# EasyEDA Pro project 20241014.epro

# Schematic EDA_LQ——13P——u
Board Name: EDA_LQ——13P——u; Create Date: 2024-10-10; Page Name: 13P1_SCH; Project Name: 20241010; Schematic Name: EDA_LQ——13P——u; Update Date: 2024-10-14; Add into BOM: yes; Company: Your Company; Convert to PCB: yes; Date: 2022-03-16; Draw By: tirion; REV: 1.0; Sheet: 1/1
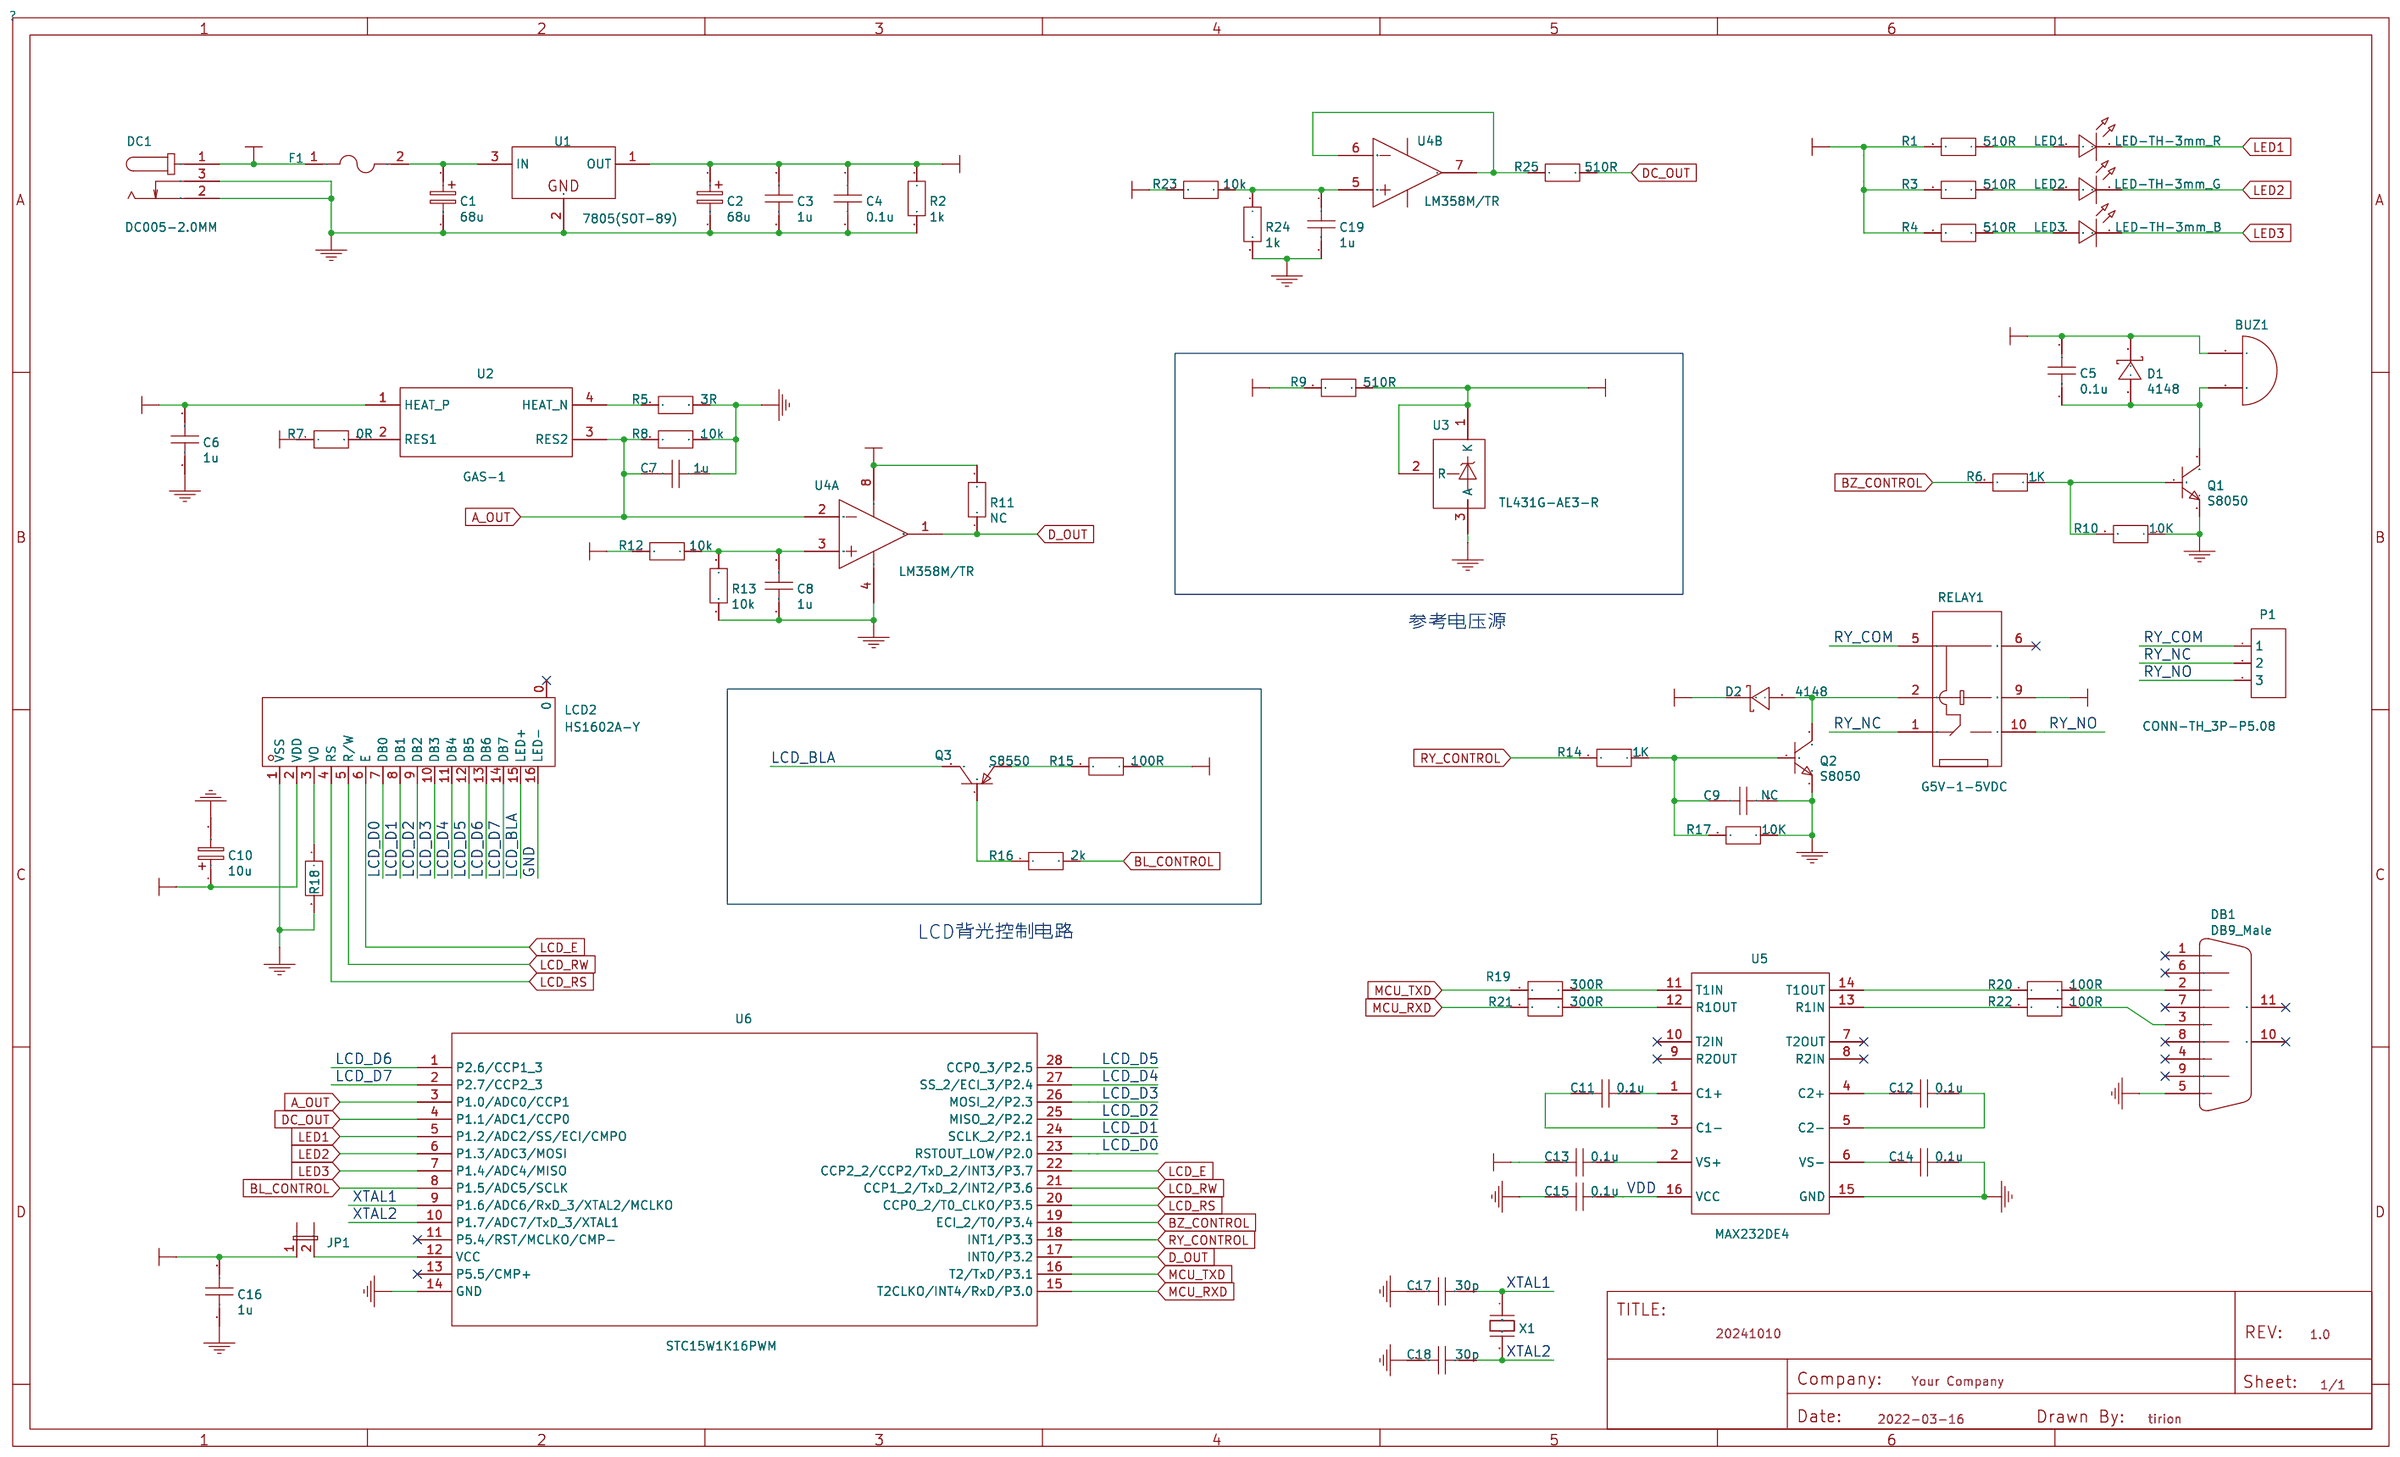
[diagram p0: schematic sheet]

## Parts
BUZ1  BUZ1  [BUZZ]
C1  68u  [CAP-D6.3×H5.5]
C2  68u  [CAP-D6.3×H5.5]
C3  1u  [C0805]
C4  0.1u  [C0805]
C5  0.1u  [C0805]
C6  1u  [C0805]
C7  1u  [C0805]
C8  1u  [C0805]
C9  NC  [C0805]
C10  10u  [CAP-D5.0×H5.5]
C11  0.1u  [C0805]
C12  0.1u  [C0805]
C13  0.1u  [C0805]
C14  0.1u  [C0805]
C15  0.1u  [C0805]
C16  1u  [C0805]
C17  30p  [C0805]
C18  30p  [C0805]
C19  1u  [C0805]
D1  4148  [SMA_L4.4-W2.8-LS5.4-RD]
D2  4148  [SMA_L4.4-W2.8-LS5.4-RD]
DB1  DB9_Male  [DSUB-TH_DMR-9P]
DC1  DC005-2.0MM  [DC-IN-TH_DC005]
F1  FUSE_F1812_FUSE  [F1812]
JP1  JUMPER2  [JUMPER2]
LCD2  HS1602A-Y  [LCD1602]
LED1  LED-TH-3mm_R  [LED-TH_BD3.0_RED]
LED2  LED-TH-3mm_G  [LED-TH_BD3.0_GREEN]
LED3  LED-TH-3mm_B  [LED-TH_BD3.0_BLUE]
P1  CONN-TH_3P-P5.08  [CONN-TH_3P-P5.08]
Q1  S8050  [SOT-23-3_L2.9-W1.3-P1.90-LS2.4-BR]
Q2  S8050  [SOT-23-3_L2.9-W1.3-P1.90-LS2.4-BR]
Q3  S8550  [SOT-23-3_L2.9-W1.3-P1.90-LS2.4-BR]
R1  510R  [R0805]
R2  1k  [R0805]
R3  510R  [R0805]
R4  510R  [R0805]
R5  3R  [R0805]
R6  1K  [R0805]
R7  0R  [R0805]
R8  10k  [R0805]
R9  510R  [R0805]
R10  10K  [R0805]
R11  NC  [R0805]
R12  10k  [R0805]
R13  10k  [R0805]
R14  1K  [R0805]
R15  100R  [R0805]
R16  2k  [R0805]
R17  10K  [R0805]
R18  10k  [R0805]
R19  300R  [R0805]
R20  100R  [R0805]
R21  300R  [R0805]
R22  100R  [R0805]
R23  10k  [R0805]
R24  1k  [R0805]
R25  510R  [R0805]
RELAY1  G5V-1-5VDC  [RELAY-TH_G5V-1]
U1  7805(SOT-89)  [SOT-89-3_L4.5-W2.5-P1.50-LS4.2-BR]
U2  GAS-1  [GAS-1]
U3  TL431G-AE3-R  [SOT-23-3_L2.9-W1.3-P1.90-LS2.4-TR]
U4  LM358M/TR  [SOP-8_L4.9-W3.9-P1.27-LS6.0-BL]  (sections 1,2)
U5  MAX232DE4  [SOIC16N]
U6  STC15W1K16PWM  [SOP-28_L17.9-W7.5-P1.27-LS10.3-BL]
X1  12MHZ  [OSC-49U-1]

## Library data of the parts
BUZ1 = BUZ1
C1 C2 = 68u
C3 C6-C8 C16 C19 = 1u
C4 C5 C11-C15 = 0.1u
C9 R11 = NC
C10 = 10u
C17 C18 = 30p
D1 D2 = SS14: Supplier: LCSC; Manufacturer: MDD; Supplier Part: C2480; JLCPCB Part Class: Basic Part
DB1 = DB9_Male: Supplier Part: C185657; Supplier: LCSC; Manufacturer: Amphenol
DC1 = DC005-2.0MM: Supplier: LCSC; Manufacturer: SOFNG; Supplier Part: C111567
F1 = FUSE_F1812_FUSE: Supplier: LCSC; Supplier Part: C9900007509; JLCPCB Part Class: Extended Part
JP1 = JUMPER2
LCD2 = HS1602A-Y: 主控芯片:SPLC780;尺寸(inch):2;; LCSC Part Name: 2寸16x2字符型8位通讯单色LCD液晶显示模组黄绿屏; Supplier Part: C18198250; Manufacturer: HS(汉昇); JLCPCB Part Class: 扩展库; Datasheet: https://atta.szlcsc.com/upload/public/pdf/source/20230921/41ABF4C08C578F5401713169C9FD3309.pdf; Supplier: LCSC; Main Control Chip: SPLC780; Size: 2; Operating Temperature: -20℃~+70℃
LED1 = 204-10SDRD/S530-A3-L: Manufacturer: EVERLIGHT(台湾亿光); Supplier Part: C84774; Supplier: LCSC
LED2 = 204-10SYGD/S530-E3: Manufacturer: EVERLIGHT(台湾亿光); Supplier Part: C85161
LED3 = 204-10SUBC/S400-A4: Manufacturer: EVERLIGHT(台湾亿光); Supplier Part: C86881; Supplier: LCSC
P1 = CONN-TH_3P-P5.08: Supplier: LCSC
Q1 Q2 = S8050: Supplier: LCSC; Supplier Part: C916390; Manufacturer: JSMSEMI; JLCPCB Part Class: Extended Part
Q3 = S8550-H: Supplier: LCSC; Supplier Part: C699225; Manufacturer: Yangzhou Yangjie Elec Tech; JLCPCB Part Class: Extended Part
R1 R3 R4 R9 R25 = 510R
R2 R24 = 1k
R5 = 3R
R6 R14 = 1K
R7 = 0R
R8 R12 R13 R18 R23 = 10k
R10 R17 = 10K
R15 R20 R22 = 100R
R16 = 2k
R19 R21 = 300R
RELAY1 = G5V-1-5VDC: Supplier: LCSC; Manufacturer: OMRON; Supplier Part: C28695; JLCPCB Part Class: Extended Part
U1 = CJ78L05: Supplier: LCSC; Manufacturer: CJ; image: //image.lceda.cn/szlcsc/C2079.jpg; Supplier Part: C2079; Paste Type: expand
U2 = GAS-1
U3 = TL431G-AE3-R: Supplier: LCSC; Manufacturer: UTC; Supplier Part: C71130; JLCPCB Part Class: Extended Part
U4 = LM358M/TR: Supplier: LCSC; Supplier Part: C398078; Manufacturer: HGSEMI
U5 = MAX232DE4
U6 = STC15W1K16PWM: Supplier: LCSC; Manufacturer: STC; Supplier Part: C65670; JLCPCB Part Class: Extended Part
X1 = X49UD12MSD2SC: Supplier Part: undefined; Supplier: LCSC; Manufacturer: LCSC

## Nets
GND: C1.2 C2.2 C3.2 C4.2 C6.1 C7.1 C8.2 C9.2 C10.2 C14.2 C15.1 C16.1 C17.2 C18.2 C19.2 DB1.5 DC1.2 DC1.3 LCD2.1(VSS) LCD2.16(LED-) Q1.2(E) Q2.2(E) R2.2 R5.2 R8.2 R10.1 R13.2 R17.1 R18.2 R24.2 U1.2(GND) U3.3(A) U4.4(GND) U5.15(GND) U6.14(GND)
VDD: BUZ1.1(A) C2.1 C3.1 C4.1 C5.2 C6.2 C10.1 C13.1 C15.2 C16.2 D1.1(K) D2.1(K) JP1.1 LCD2.2(VDD) R1.2 R2.1 R3.2 R4.2 R9.2 R11.2 R15.2 RELAY1.9 U1.1(OUT) U2.1(HEAT_P) U4.8(VCC) U5.16(VCC)
A_OUT: C7.2 R8.1 U2.3(RES2) U4.2(1IN-) U6.3(P1.0/ADC0/CCP1)
BL_CONTROL: R16.2 U6.8(P1.5/ADC5/SCLK)
BZ_CONTROL: R6.2 U6.19(ECI_2/T0/P3.4)
D_OUT: R11.1 U4.1(1OUT) U6.17(INT0/P3.2)
DC_IN: DC1.1 F1.1 R23.2
DC_OUT: R25.1 U6.4(P1.1/ADC1/CCP0)
LCD_BLA: LCD2.15(LED+) Q3.3(C)
LCD_D0: LCD2.7(DB0) U6.23(RSTOUT_LOW/P2.0)
LCD_D1: LCD2.8(DB1) U6.24(SCLK_2/P2.1)
LCD_D2: LCD2.9(DB2) U6.25(MISO_2/P2.2)
LCD_D3: LCD2.10(DB3) U6.26(MOSI_2/P2.3)
LCD_D4: LCD2.11(DB4) U6.27(SS_2/ECI_3/P2.4)
LCD_D5: LCD2.12(DB5) U6.28(CCP0_3/P2.5)
LCD_D6: LCD2.13(DB6) U6.1(P2.6/CCP1_3)
LCD_D7: LCD2.14(DB7) U6.2(P2.7/CCP2_3)
LCD_E: LCD2.6(E) U6.22(CCP2_2/CCP2/TxD_2/INT3/P3.7)
LCD_RS: LCD2.4(RS) U6.20(CCP0_2/T0_CLKO/P3.5)
LCD_RW: LCD2.5(R/W) U6.21(CCP1_2/TxD_2/INT2/P3.6)
LED1: LED1.2 U6.5(P1.2/ADC2/SS/ECI/CMPO)
LED2: LED2.2 U6.6(P1.3/ADC3/MOSI)
LED3: LED3.2 U6.7(P1.4/ADC4/MISO)
MCU_RXD: R21.1 U6.15(T2CLKO/INT4/RxD/P3.0)
MCU_TXD: R19.1 U6.16(T2/TxD/P3.1)
RY_COM: P1.1 RELAY1.5
RY_CONTROL: R14.2 U6.18(INT1/P3.3)
RY_NC: P1.2 RELAY1.1
RY_NO: P1.3 RELAY1.10
VREF: R7.1 R9.1 R12.2 U3.1(K) U3.2(R)
XTAL1: C17.1 U6.9(P1.6/ADC6/RxD_3/XTAL2/MCLKO) X1.1(OSC1)
XTAL2: C18.1 U6.10(P1.7/ADC7/TxD_3/XTAL1) X1.2(OSC2)
$1N2: R5.1 U2.4(HEAT_N)
$1N9: C8.1 R12.1 R13.1 U4.3(1IN+)
$1N21: C11.2 U5.1(C1+)
$1N22: C11.1 U5.3(C1-)
$1N25: C13.2 U5.2(VS+)
$1N27: C12.1 U5.4(C2+)
$1N28: C12.2 U5.5(C2-)
$1N29: C14.1 U5.6(VS-)
$1N32: R19.2 U5.11(T1IN)
$1N34: R21.2 U5.12(R1OUT)
$1N35: R20.1 U5.14(T1OUT)
$1N36: DB1.2 R20.2
$1N37: R22.1 U5.13(R1IN)
$1N38: DB1.3 R22.2
$1N41: JP1.2 U6.12(VCC)
$1N43: D2.2(A) Q2.3(C) RELAY1.2
$1N44: C9.1 Q2.1(B) R14.1 R17.2
$1N59: Q1.1(B) R6.1 R10.2
$1N60: BUZ1.2(B) C5.1 D1.2(A) Q1.3(C)
$1N64: LCD2.3(VO) R18.1
$1N97: LED1.1 R1.1
$1N99: LED3.1 R4.1
$1N100: LED2.1 R3.1
$1N103: C1.1 F1.2 U1.3(IN)
$1N105: R25.2 U4.6(2IN-) U4.7(2OUT)
$1N107: C19.1 R23.1 R24.1 U4.5(2IN+)
$1N1047: R7.2 U2.2(RES1)
$1N2313: Q3.1(B) R16.1
$1N2322: Q3.2(E) R15.1

Not connected (* = marked no-connect by the designer): DB1 1* 4* 6* 7* 8* 9* 10(MH1)* 11(MH2)*; LCD2 0*; RELAY1 6*; U5 7(T2OUT)* 8(R2IN)* 9(R2OUT)* 10(T2IN)*; U6 11(P5.4/RST/MCLKO/CMP-)* 13(P5.5/CMP+)*

## Notes on the sheet
- 参考电压源
- LCD背光控制电路

# Board PCB
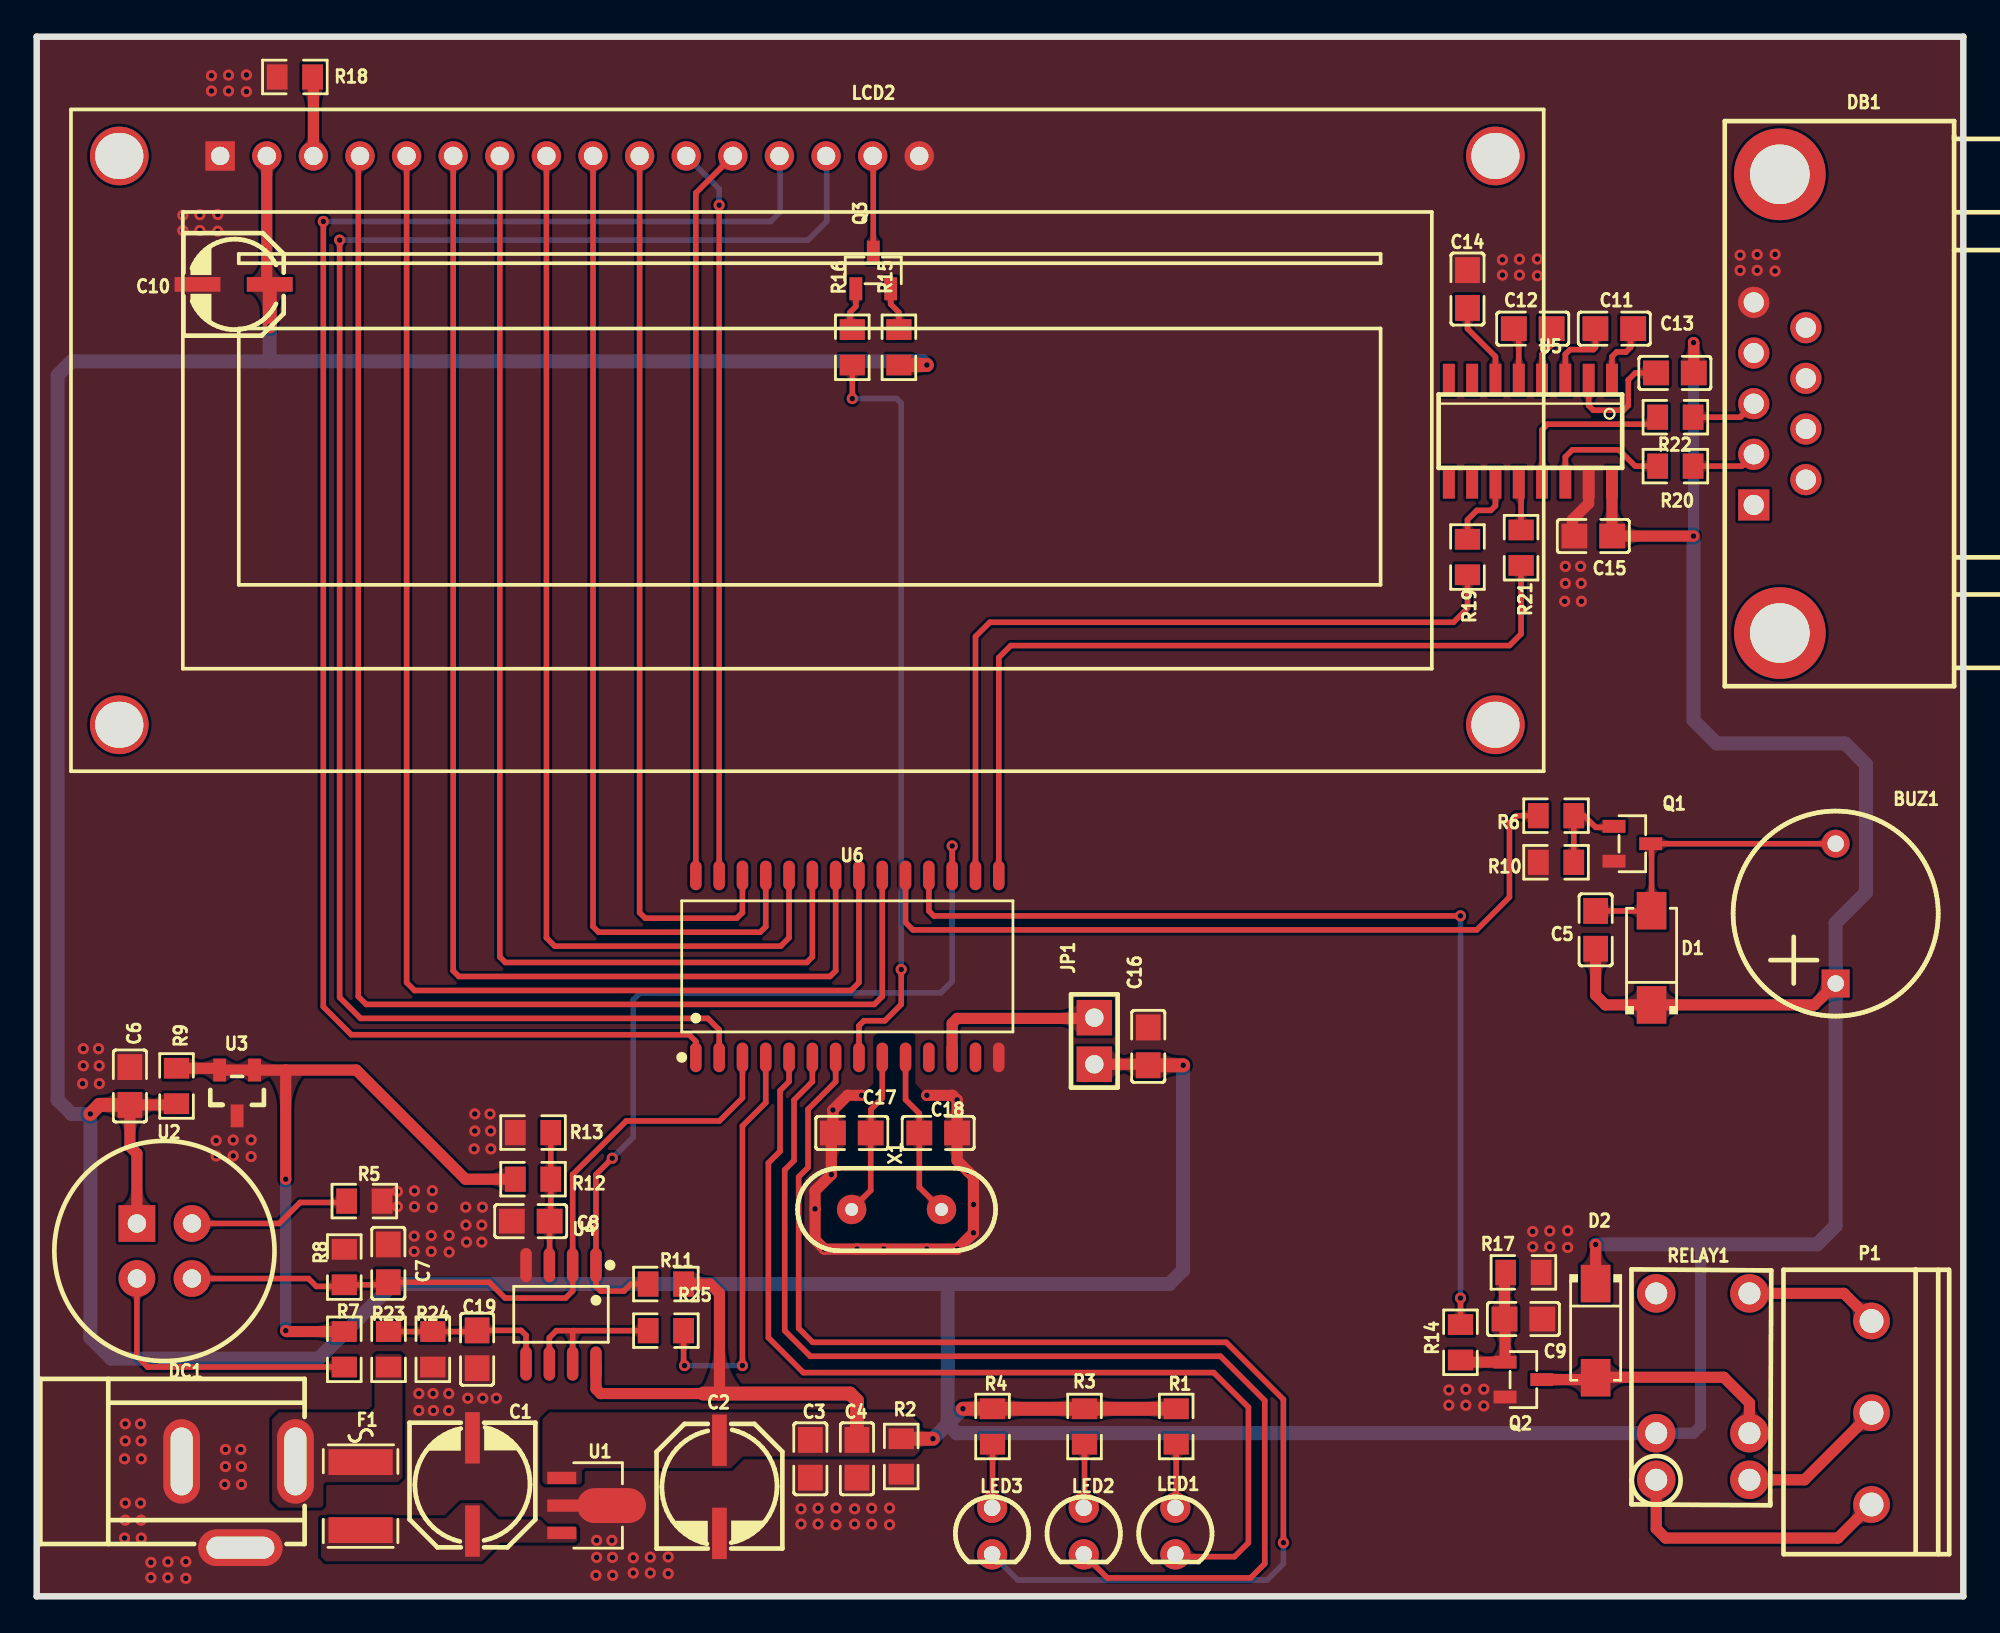
[diagram p1: board, top side]
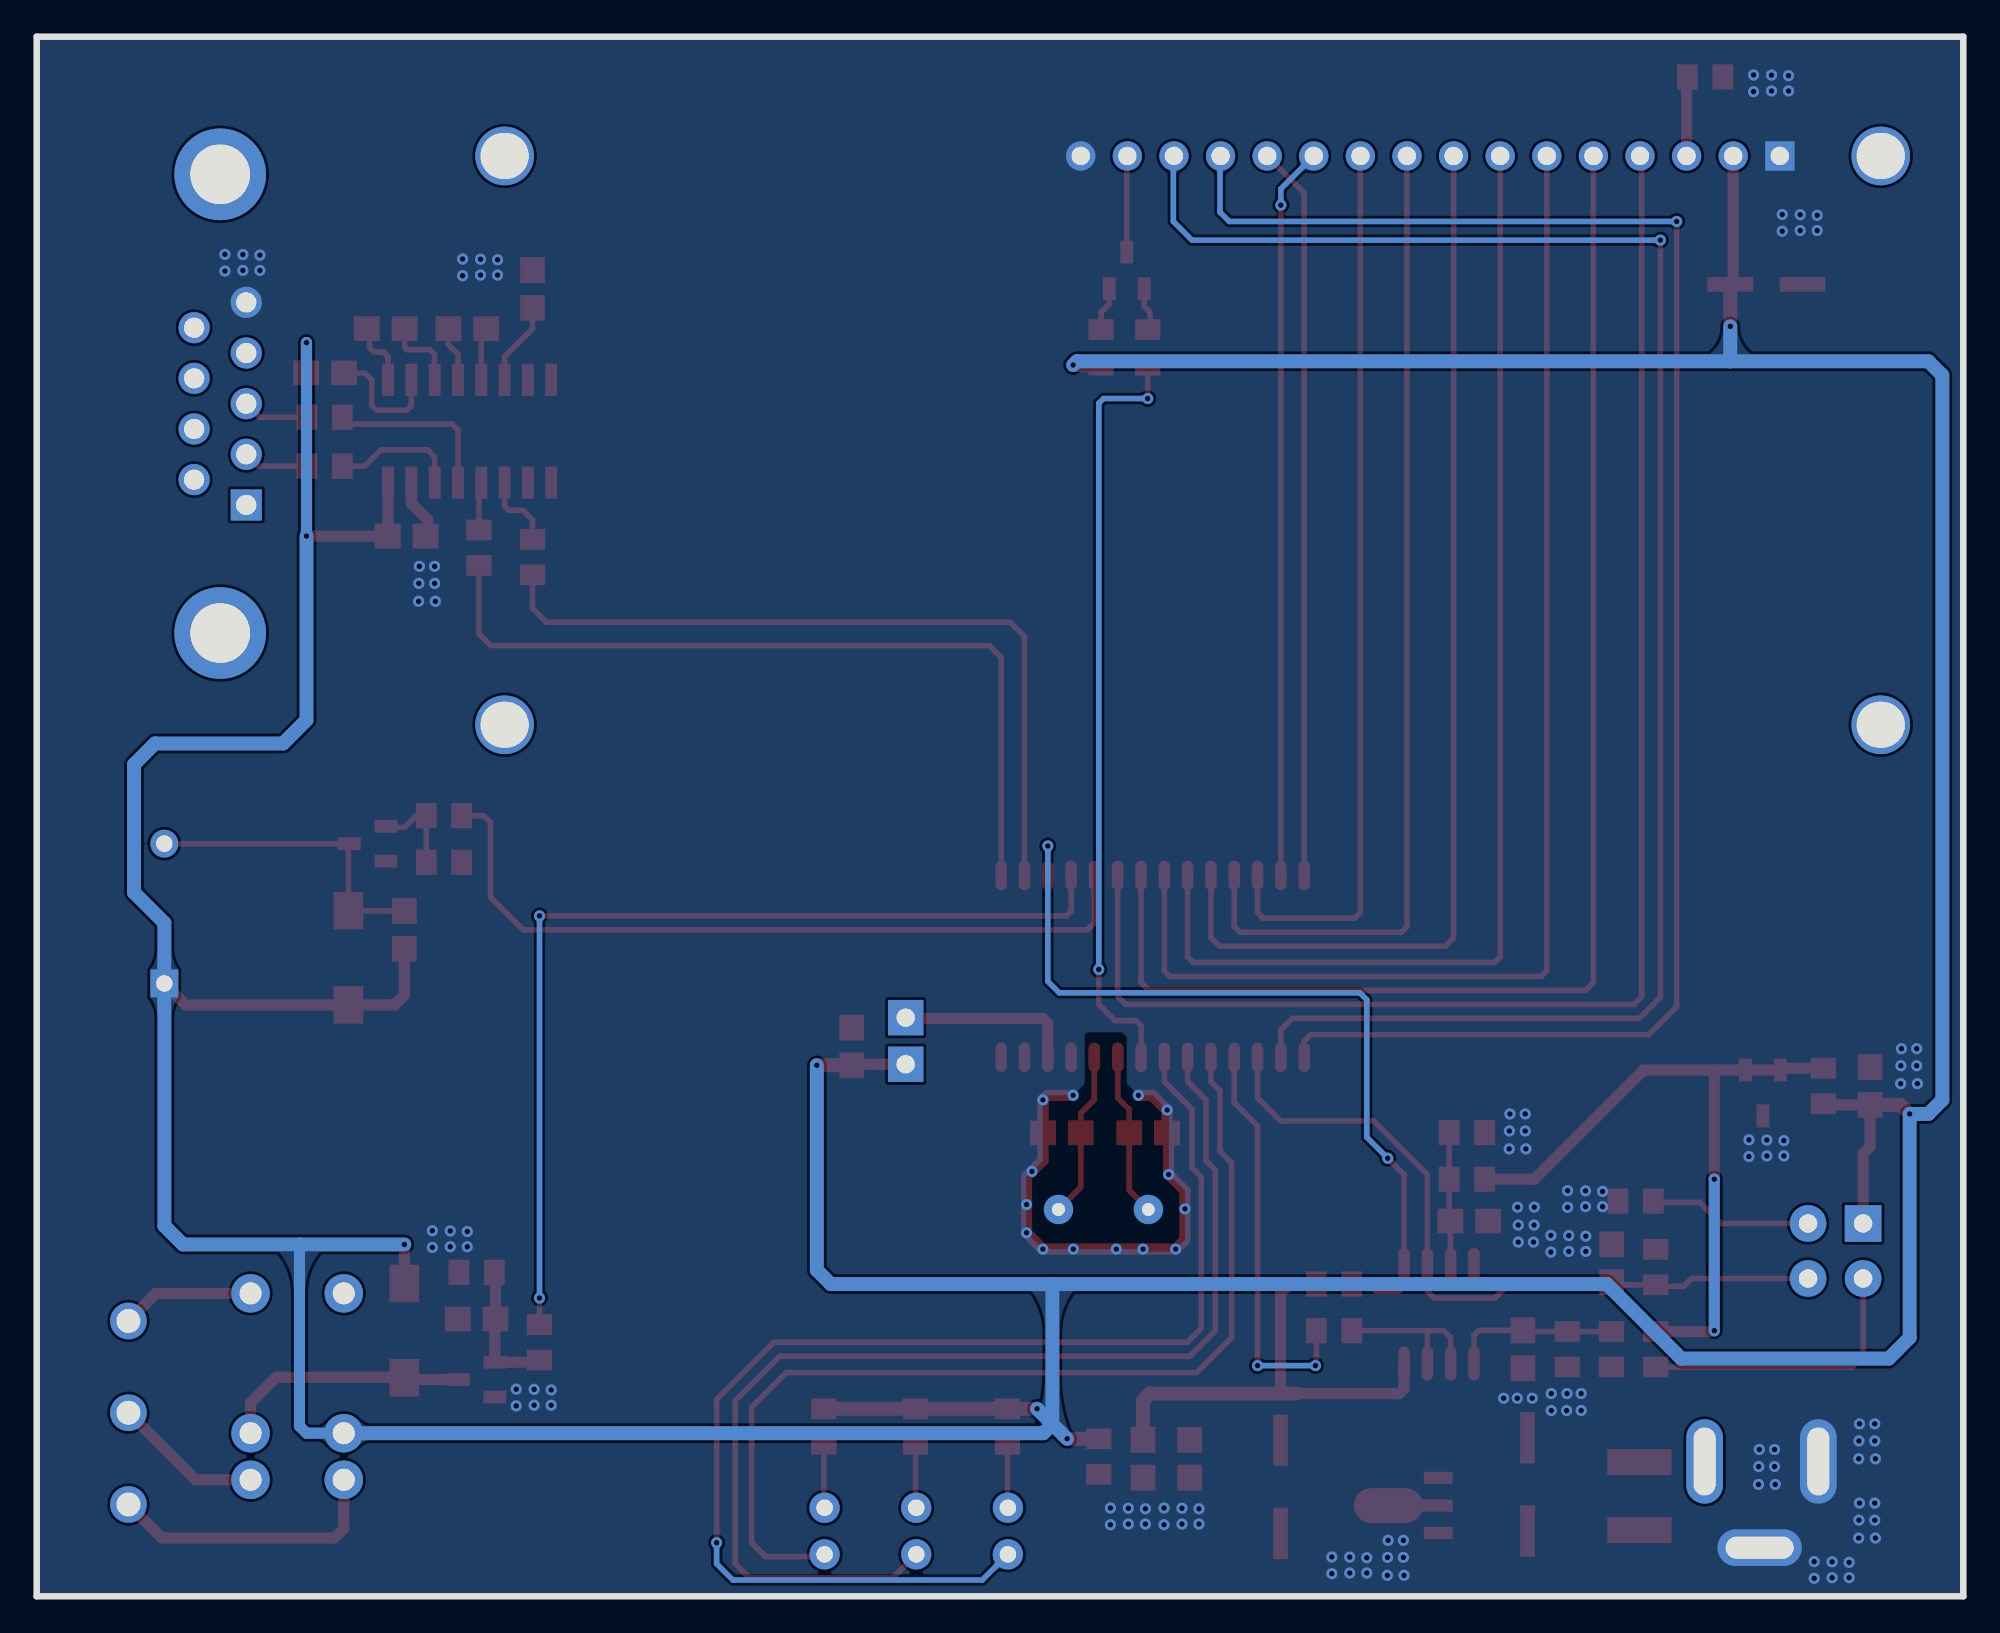
[diagram p2: board, bottom side, seen from below]

Outline 105 x 85 mm; copper layers: Top Layer, Bottom Layer. Coordinates in mm from the lower left corner of the outline.
Outline path: 0,85 105,85 105,0 0,0 0,85
Stack: Top Layer 0.035mm / Dielectric1 1.51mm FR4 er 4.5 / Bottom Layer 0.035mm

## Design rules (mm)
template: 用户自定义配置
spacing Default (default): track to track 0.305, other pairs 0.305 to 0.305
track width Default (default): min 0.305, default 0.305, max 25.4
differential pair differentialPair (default): width min 0.127, default 0.254, max 2.54; gap min 0.152, default 0.152
via Default (default): diameter min 0.61, default 0.61, max 100.025; hole min 0.305, default 0.305, max 59.995

## Placement (name value [footprint] x y rotation side)
BUZ1  BUZ1  [BUZZ]  98.04 33.4 90 top
C1  68u  [CAP-D6.3×H5.5]  23.75 8.64 270 top
C2  68u  [CAP-D6.3×H5.5]  37.21 3.43 90 top
C3  1u  [C0805]  42.16 7.49 270 top
C4  0.1u  [C0805]  44.7 7.49 270 top
C5  0.1u  [C0805]  84.96 36.32 270 top
C6  1u  [C0805]  5.08 27.81 270 top
C7  1u  [C0805]  19.16 18.15 270 top
C8  1u  [C0805]  26.92 20.45 180 top
C9  NC  [C0805]  81.03 15.11 0 top
C10  10u  [CAP-D5.0×H5.5]  8.76 71.5 0 top
C11  0.1u  [C0805]  85.98 69.09 0 top
C12  0.1u  [C0805]  81.53 69.09 180 top
C13  0.1u  [C0805]  89.28 66.67 180 top
C14  0.1u  [C0805]  77.98 71.25 90 top
C15  0.1u  [C0805]  84.84 57.78 0 top
C16  1u  [C0805]  60.58 29.97 270 top
C17  30p  [C0805]  44.42 25.25 180 top
C18  30p  [C0805]  49.13 25.25 0 top
C19  1u  [C0805]  24 13.46 270 top
D1  4148  [SMA_L4.4-W2.8-LS5.4-RD]  88.01 34.8 90 top
D2  4148  [SMA_L4.4-W2.8-LS5.4-RD]  84.96 14.48 270 top
DB1  DB9_Male  [DSUB-TH_DMR-9P]  95 65 0 top
DC1  DC005-2.0MM  [DC-IN-TH_DC005]  11 5 0 top
F1  FUSE_F1812_FUSE  [F1812]  17.65 5.46 270 top
JP1  -  [JUMPER2]  57.64 30.27 270 top
LCD2  HS1602A-Y  [LCD1602]  42 63 0 top
LED1  LED-TH-3mm_R  [LED-TH_BD3.0_RED]  62.06 3.56 0 top
LED2  LED-TH-3mm_G  [LED-TH_BD3.0_GREEN]  57.06 3.56 0 top
LED3  LED-TH-3mm_B  [LED-TH_BD3.0_BLUE]  52.07 3.56 0 top
P1  -  [CONN-TH_3P-P5.08]  100 10 270 top
Q1  S8050  [SOT-23-3_L2.9-W1.3-P1.90-LS2.4-BR]  86.96 41.02 180 top
Q2  S8050  [SOT-23-3_L2.9-W1.3-P1.90-LS2.4-BR]  81.03 11.81 180 top
Q3  S8550  [SOT-23-3_L2.9-W1.3-P1.90-LS2.4-BR]  45.59 72.26 270 top
R1  510R  [R0805]  62.1 9.25 90 top
R2  1k  [R0805]  47.12 7.62 270 top
R3  510R  [R0805]  57.11 9.25 90 top
R4  510R  [R0805]  52.09 9.25 90 top
R5  3R  [R0805]  17.86 21.54 0 top
R6  1K  [R0805]  82.8 42.55 180 top
R7  0R  [R0805]  16.76 13.46 270 top
R8  10k  [R0805]  16.76 17.94 90 top
R9  510R  [R0805]  7.62 27.81 270 top
R10  10K  [R0805]  82.8 40 0 top
R11  NC  [R0805]  34.29 17.02 0 top
R12  10k  [R0805]  27.05 22.73 180 top
R13  10k  [R0805]  27.05 25.27 180 top
R14  1K  [R0805]  77.6 13.84 90 top
R15  100R  [R0805]  46.99 68.07 270 top
R16  2k  [R0805]  44.45 68.07 270 top
R17  10K  [R0805]  81.03 17.65 180 top
R18  10k  [R0805]  14.07 82.8 180 top
R19  300R  [R0805]  77.98 56.64 90 top
R20  100R  [R0805]  89.31 61.59 0 top
R21  300R  [R0805]  80.9 57.15 90 top
R22  100R  [R0805]  89.31 64.26 0 top
R23  10k  [R0805]  19.18 13.46 270 top
R24  1k  [R0805]  21.59 13.46 270 top
R25  510R  [R0805]  34.29 14.48 180 top
RELAY1  G5V-1-5VDC  [RELAY-TH_G5V-1]  90.81 11.43 90 top
U1  7805(SOT-89)  [SOT-89-3_L4.5-W2.5-P1.50-LS4.2-BR]  29.97 4.95 180 top
U2  -  [GAS-1]  5.46 20.32 0 top
U3  TL431G-AE3-R  [SOT-23-3_L2.9-W1.3-P1.90-LS2.4-TR]  10.92 27.43 90 top
U4  LM358M/TR  [SOP-8_L4.9-W3.9-P1.27-LS6.0-BL]  28.57 15.37 180 top
U5  MAX232DE4  [SOIC16N]  81.41 63.5 180 top
U6  STC15W1K16PWM  [SOP-28_L17.9-W7.5-P1.27-LS10.3-BL]  44.18 34.33 0 top
X1  12MHZ  [OSC-49U-1]  46.86 21.08 90 top

## Footprints (pads in the part's own frame, mm; a bottom-side part is the same pattern mirrored in y, then rotated)
BUZZ
  rect 1.524x1.524 hole 0.894x0.889: 1(0,0)
  round 1.524 hole 0.894x0.889: 2(7.62,0)
C0805
  rect 1.41x1.35 smd: 1(-1.03,0) 2(1.03,0)
CAP-D5.0×H5.5
  rect 2.5x0.8 smd: 1(3.937,0) 2(0,0)
CAP-D6.3×H5.5
  rect 2.8x0.8 smd: 1(5.08,0) 2(0,0)
CONN-TH_3P-P5.08
  round 2 hole 1.3: 1(-5.005,0) 2(-0.005,0) 3(4.995,0)
DC-IN-TH_DC005
  oval 2x4.6 hole 1.2x3.7: 1(3.1,2.35) 2(-3.1,2.35)
  oval 4.6x2 hole 3.7x1.2: 3(0.1,-2.35)
DSUB-TH_DMR-9P
  rect 1.7x1.7 hole 1.1: 1(-1.42,-5.52)
  round 1.7 hole 1.1: 2(-1.42,-2.76) 3(-1.42,0) 4(-1.42,2.76) 5(-1.42,5.52) 6(1.42,-4.14) 7(1.42,-1.38) 8(1.42,1.38) 9(1.42,4.14)
  round 5 hole 3.25: 10(0,12.5) 11(0,-12.5)
F1812
  rect 1.407x3.499 smd: 1(-1.853,0) 2(1.853,0)
GAS-1
  rect 2x2 hole 1: 1(0,0)
  round 2 hole 1: 2(0,-3) 3(3,-3) 4(3,0)
JUMPER2
  rect 1.931x1.931 hole 1.001: 1(1.27,0) 2(-1.27,0)
LCD1602
  round 3.2 hole 2.625x2.5: 0(-37.5,15.5) 0(-37.5,-15.5) 0(37.5,15.5) 0(37.5,-15.5)
  rect 1.6x1.6 hole 1: 1(-32,15.5)
  round 1.6 hole 1: 2(-29.46,15.5) 3(-26.92,15.5) 4(-24.38,15.5) 5(-21.84,15.5) 6(-19.3,15.5) 7(-16.76,15.5) 8(-14.22,15.5) 9(-11.68,15.5) 10(-9.14,15.5) 11(-6.6,15.5) 12(-4.06,15.5) 13(-1.52,15.5) 14(1.02,15.5) 15(3.56,15.5) 16(6.1,15.5)
LED-TH_BD3.0_BLUE
  round 1.651 hole 0.9: 1(0,1.27) 2(0,-1.27)
LED-TH_BD3.0_GREEN
  round 1.651 hole 0.9: 1(0,1.27) 2(0,-1.27)
LED-TH_BD3.0_RED
  round 1.651 hole 0.9: 1(0,1.27) 2(0,-1.27)
OSC-49U-1
  round 1.6 hole 0.7: 1(0,2.45) 2(0,-2.45)
R0805
  rect 1.133x1.377 smd: 1(-0.966,0) 2(0.966,0)
RELAY-TH_G5V-1
  round 2.1 hole 1.2: 1(-5.08,-2.54) 2(-2.54,-2.54) 5(5.08,-2.54) 6(5.08,2.54) 9(-2.54,2.54) 10(-5.08,2.54)
SMA_L4.4-W2.8-LS5.4-RD
  rect 2.046x1.62 smd: 1(-2.566,0) 2(2.566,0)
SOIC16N
  rect 0.65x1.75 smd: 1(-4.445,-2.799) 2(-3.175,-2.799) 3(-1.905,-2.799) 4(-0.635,-2.799) 5(0.635,-2.799) 6(1.905,-2.799) 7(3.175,-2.799) 8(4.445,-2.799) 9(4.445,2.799) 10(3.175,2.799) 11(1.905,2.799) 12(0.635,2.799) 13(-0.635,2.799) 14(-1.905,2.799) 15(-3.175,2.799) 16(-4.445,2.799)
SOP-8_L4.9-W3.9-P1.27-LS6.0-BL
  oval 0.63x1.865 smd: 1(-1.905,-2.683) 2(-0.635,-2.683) 3(0.635,-2.683) 4(1.905,-2.683) 5(1.905,2.683) 6(0.635,2.683) 7(-0.635,2.683) 8(-1.905,2.683)
SOP-28_L17.9-W7.5-P1.27-LS10.3-BL
  oval 0.63x1.615 smd: 1(-8.255,-4.957) 2(-6.985,-4.957) 3(-5.715,-4.957) 4(-4.445,-4.957) 5(-3.175,-4.957) 6(-1.905,-4.957) 7(-0.635,-4.957) 8(0.635,-4.957) 9(1.905,-4.957) 10(3.175,-4.957) 11(4.445,-4.957) 12(5.715,-4.957) 13(6.985,-4.957) 14(8.255,-4.957) 15(8.255,4.957) 16(6.985,4.957) 17(5.715,4.957) 18(4.445,4.957) 19(3.175,4.957) 20(1.905,4.957) 21(0.635,4.957) 22(-0.635,4.957) 23(-1.905,4.957) 24(-3.175,4.957) 25(-4.445,4.957) 26(-5.715,4.957) 27(-6.985,4.957) 28(-8.255,4.957)
SOT-23-3_L2.9-W1.3-P1.90-LS2.4-BR
  rect 1.25x0.7 smd: 1(1,-0.95) 2(1,0.95) 3(-1,0)
SOT-23-3_L2.9-W1.3-P1.90-LS2.4-TR
  rect 1.25x0.7 smd: 1(1.25,0.95) 2(1.25,-0.95) 3(-1.25,0)
SOT-89-3_L4.5-W2.5-P1.50-LS4.2-BR
  rect 1.575x0.672 smd: 1(1.356,-1.5) 3(1.356,1.5)
  custom 5.377x1.9 smd: 2(-1.356,0.009)

## Nets
As in the schematic.

Pads without a net: DB1 1 4 6 7 8 9 10 11; LCD2 0; RELAY1 6; U5 7 8 9 10; U6 11 13

## Via types
v1: diameter 0.61, hole 0.305, Top Layer to Bottom Layer, 172 vias

## Routing (per net, layer and track width the routed paths; a pad name or vN(x,y) marks a point on that pad's centre or on a via; arc(x,y) is an arc through that point)
GND: length 31.3
  Top Layer w0.61: C15.1 83.69,57.9 83.69,58.67 84.58,59.56 U5.15 ; v1(44.96,27.31) 44.2,27.31 v1(43.39,26.5) C17.2 43.31,25.17 v1(43.31,22.99) 42.42,22.1 v1(42.42,21.12) 42.42,19.43 v1(42.93,18.92) v1(44.71,18.92) v1(46.16,18.92) v1(48.51,18.92) v1(50.16,18.92) v1(51.05,19.81) v1(51.05,21.35) 51.05,22.86 v1(50.76,23.16) 50.16,23.75 C18.2 v1(50.16,27.05) 49.91,27.31 v1(48.51,27.31)
  vias: v1(2.54,29.84) v1(2.54,28.92) v1(2.5,27.94) v1(3.37,29.84) v1(3.4,28.92) v1(3.41,27.94) v1(4.83,9.4) v1(4.83,8.47) v1(4.79,7.49) v1(4.83,5.08) v1(4.83,4.15) v1(4.79,3.18) v1(5.66,9.4) v1(5.69,8.47) v1(5.7,7.49) v1(5.66,5.08) v1(5.69,4.15) v1(5.7,3.18) v1(6.22,1.85) v1(6.22,1.02) v1(7.15,1.88) v1(7.15,1.02) v1(7.96,75.27) v1(7.96,74.44) v1(8.13,1.89) v1(8.13,0.98) v1(8.89,75.3) v1(8.89,74.44) v1(9.53,82.87) v1(9.53,82.04) v1(9.78,24.84) v1(9.78,24) v1(9.87,75.31) v1(9.87,74.4) v1(10.29,8) v1(10.29,7.07) v1(10.25,6.1) v1(10.45,82.91) v1(10.45,82.04) v1(10.71,24.87) v1(10.71,24) v1(11.12,8) v1(11.15,7.07) v1(11.16,6.1) v1(11.43,82.92) v1(11.43,82.01) v1(11.68,24.88) v1(11.68,23.97) v1(19.66,22.07) v1(19.66,21.23) v1(20.59,22.1) v1(20.59,21.23) v1(20.57,19.63) v1(20.57,18.8) v1(20.83,11.05) v1(20.82,10.12) v1(21.5,19.66) v1(21.5,18.8) v1(21.56,22.11) v1(21.56,21.2) v1(21.6,11.05) v1(21.62,10.12) v1(22.48,19.67) v1(22.48,18.76) v1(22.46,11.05) v1(22.46,10.12) v1(23.38,21.21) v1(23.39,20.23) v1(23.42,19.3) v1(23.5,10.79) v1(23.84,24.38) v1(23.88,26.29) v1(23.88,25.36) v1(24.29,21.21) v1(24.26,20.23) v1(24.26,19.3) v1(24.31,10.79) v1(24.71,26.29) v1(24.74,25.36) v1(24.75,24.38) v1(25.05,10.79) v1(30.52,3.05) v1(30.52,2.12) v1(30.48,1.14) v1(31.35,3.05) v1(31.38,2.12) v1(31.39,1.14) v1(32.51,2.1) v1(32.51,1.27) v1(33.44,2.13) v1(33.44,1.27) v1(34.42,2.14) v1(34.42,1.23) v1(41.66,4.77) v1(41.66,3.94) v1(42.58,4.8) v1(42.58,3.94) v1(43.56,4.81) v1(43.56,3.9) v1(44.58,4.77) v1(44.58,3.94) v1(45.51,4.8) v1(45.51,3.94) v1(46.48,4.81) v1(46.48,3.9) v1(76.96,11.25) v1(76.96,10.41) v1(77.89,11.28) v1(77.89,10.41) v1(78.87,11.29) v1(78.87,10.38) v1(79.88,72.84) v1(79.88,72.01) v1(80.81,72.87) v1(80.81,72.01) v1(81.53,19.88) v1(81.53,19.05) v1(81.79,72.88) v1(81.79,71.97) v1(82.46,19.91) v1(82.46,19.05) v1(83.31,56.13) v1(83.31,55.21) v1(83.28,54.23) v1(83.44,19.92) v1(83.44,19.01) v1(84.14,56.13) v1(84.18,55.21) v1(84.19,54.23) v1(92.84,73.1) v1(92.84,72.26) v1(93.77,73.13) v1(93.77,72.26) v1(94.74,73.14) v1(94.74,72.23)
VDD: length 401.9
  Top Layer w0.61: C10.1 12.54,71.66 LCD2.2 ; v1(90.3,68.33) 90.31,68.31 C13.1 ; C5.2 84.96,32.77 85.5,32.23 D1.1 96.88,32.23 BUZ1.1 ; U4.8 30.48,11.3 30.73,11.05 36.32,11.05 ; U5.16 85.85,57.8 C15.2 v1(90.3,57.78) ; 37.21,11.05 37.21,16.51 36.7,17.02 R11.2 ; U2.1 5.46,24.13 5.08,24.51 C6.2 7.56,26.78 R9.2 ; JP1.1 60.53,29 C16.2 ; v1(84.96,19.18) D2.1
  Top Layer w0.762: 36.32,11.05 44.32,11.05 44.7,10.67 C4.1 ; C10.1 v1(12.7,69.22) ; v1(2.92,26.29) 3.42,26.78 C6.2 ; R1.2 R3.2 R4.2 v1(50.48,10.22) ; C16.2 v1(62.48,28.94) ; R15.2 v1(48.51,67.11) ; R2.1 v1(48.84,8.59)
  Bottom Layer w0.61: v1(90.3,68.33) v1(90.3,57.78) ; 88.26,8.89 90.3,8.89 90.68,9.27 90.68,19.18
  Bottom Layer w0.762: 12.7,67.31 v1(12.7,69.22) ; 12.7,67.31 1.91,67.31 1.14,66.55 1.14,27.05 1.91,26.29 v1(2.92,26.29) 2.92,14.1 4.06,12.95 15.37,12.95 19.43,17.02 49.66,17.02 ; 12.7,67.31 48.31,67.31 v1(48.51,67.11) ; v1(90.3,57.78) 90.3,47.75 91.57,46.48 98.55,46.48 99.69,45.34 99.69,38.35 98.04,36.7 BUZ1.1 98.04,20.19 97.03,19.18 v1(84.96,19.18) ; v1(48.84,8.59) 49.65,9.39 ; 49.65,9.39 50.14,8.89 88.26,8.89 ; 49.65,9.39 49.65,17.01 49.66,17.02 ; 49.65,9.39 v1(50.48,10.22) ; v1(62.48,28.94) 62.48,17.78 61.72,17.02 49.66,17.02
A_OUT: length 41.1
  Top Layer w0.305: U6.3 38.46,27.16 37.21,25.91 32.13,25.91 29.21,22.99 U4.2 29.21,16.64 28.83,16.26 25.53,16.26 24.67,17.12 C7.2 19.02,16.98 R8.1 16.68,16.89 15.24,16.89 14.81,17.32 U2.3
BL_CONTROL: length 41.9
  Top Layer w0.305: v1(44.45,65.28) R16.2 ; v1(47.12,34.16) 47.12,32.26 46.23,31.37 45.09,31.37 44.81,31.1 U6.8
  Bottom Layer w0.305: v1(44.45,65.28) 46.86,65.28 47.12,65.02 v1(47.12,34.16)
BZ_CONTROL: length 42.2
  Top Layer w0.305: U6.19 47.35,36.72 47.75,36.32 78.49,36.32 80.26,38.1 80.26,42.16 80.65,42.55 R6.2
D_OUT: length 46.4
  Top Layer w0.305: R11.1 32.38,17.02 32,16.64 30.73,16.64 30.48,16.89 U4.1 30.48,22.99 v1(31.37,23.88) ; U6.17 v1(49.89,40.89)
  Bottom Layer w0.305: v1(49.89,40.89) 49.89,33.51 49.28,32.89 32.89,32.89 32.51,32.51 32.51,25.02 v1(31.37,23.88)
DC_OUT: length 22.4
  Top Layer w0.305: R25.1 35.26,12.62 v1(35.31,12.57) ; v1(38.46,12.57) 38.46,25.64 39.73,26.91 U6.4
  Bottom Layer w0.305: v1(38.46,12.57) v1(35.31,12.57)
LCD_BLA: length 5.3
  Top Layer w0.305: Q3.3 45.59,78.47 LCD2.15
LCD_D0: length 65.4
  Top Layer w0.305: LCD2.7 25.24,34.85 25.55,34.54 41.97,34.54 42.27,34.85 U6.23 42.29,39.31
LCD_D1: length 59.6
  Top Layer w0.305: 41.02,39.31 U6.24 41,35.89 40.55,35.43 28.24,35.43 27.78,35.89 LCD2.8
LCD_D2: length 54.5
  Top Layer w0.305: 39.75,39.31 U6.25 39.73,36.5 39.43,36.19 30.62,36.19 30.32,36.5 LCD2.9
LCD_D3: length 49.1
  Top Layer w0.305: LCD2.10 32.86,37.26 33.16,36.96 38.16,36.96 38.46,37.26 U6.26
LCD_D4: length 40
  Top Layer w0.305: v1(37.19,75.82) U6.27 37.21,39.31
  Bottom Layer w0.305: LCD2.11 37.19,76.71 v1(37.19,75.82)
LCD_D5: length 40.1
  Top Layer w0.305: LCD2.12 35.92,76.48 35.92,39.35 ; 35.92,39.35 35.94,39.36 ; 35.92,39.35 U6.28
LCD_D6: length 92.9
  Top Layer w0.305: U6.1 35.92,30.24 35.56,30.61 17.14,30.61 15.62,32.13 v1(15.62,74.93)
  Bottom Layer w0.305: LCD2.13 40.51,78.47 40.51,75.44 40,74.93 v1(15.62,74.93)
LCD_D7: length 94.7
  Top Layer w0.305: v1(16.51,73.91) 16.51,32.64 17.65,31.5 36.58,31.5 37.19,30.88 U6.2
  Bottom Layer w0.305: v1(16.51,73.91) 42.04,73.91 43.05,74.93 43.05,78.47 LCD2.14
LCD_E: length 70.7
  Top Layer w0.305: 43.56,39.31 U6.22 43.54,34.09 43.24,33.78 23,33.78 22.7,34.09 LCD2.6
LCD_RS: length 81.4
  Top Layer w0.305: LCD2.4 17.53,78.41 17.53,32.69 17.96,32.26 45.65,32.26 46.08,32.69 U6.20 46.1,39.31
LCD_RW: length 75.9
  Top Layer w0.305: 44.83,39.31 U6.21 44.81,33.45 44.38,33.02 20.59,33.02 20.16,33.45 LCD2.5
LED1: length 55.2
  Top Layer w0.305: LED1.2 62.19,2.16 65.28,2.16 66.04,2.92 66.04,10.3 64.15,12.19 41.78,12.19 39.88,14.1 39.88,23.62 40.51,24.26 40.51,27.56 41,28.05 U6.5
LED2: length 62.9
  Top Layer w0.305: LED2.2 58.35,1 66.15,1 66.93,1.78 66.93,10.67 64.52,13.08 42.16,13.08 40.77,14.48 40.77,23.24 41.28,23.75 41.28,27.05 42.27,28.05 U6.6
LED3: length 69.4
  Top Layer w0.305: v1(67.94,2.92) 67.94,10.73 64.83,13.84 42.29,13.84 41.53,14.6 41.53,22.86 42.04,23.37 42.04,26.54 43.54,28.05 U6.7
  Bottom Layer w0.305: v1(67.94,2.92) 67.94,1.78 67.06,0.89 53.47,0.89 LED3.2
MCU_RXD: length 44.6
  Top Layer w0.305: R21.1 80.9,52.45 80.26,51.82 53.09,51.82 52.43,51.16 U6.15
MCU_TXD: length 42.3
  Top Layer w0.305: R19.1 77.98,53.85 77.22,53.09 51.94,53.09 51.16,52.31 U6.16
RY_COM: length 7.3
  Top Layer w0.61: P1.1 98.5,16.51 RELAY1.5
RY_CONTROL: length 53.3
  Top Layer w0.305: v1(77.6,37.08) 48.9,37.08 48.62,37.36 U6.18 ; v1(77.6,16.26) R14.2
  Bottom Layer w0.305: v1(77.6,37.08) v1(77.6,16.26)
RY_NC: length 8.2
  Top Layer w0.61: RELAY1.1 96.34,6.35 P1.2
RY_NO: length 15.4
  Top Layer w0.61: P1.3 98.17,3.18 88.77,3.18 88.26,3.68 88.26,6.35
VREF: length 38.4
  Top Layer w0.61: v1(13.57,14.48) 13.62,14.43 R7.1 ; 26.08,22.73 23.37,22.73 17.42,28.68 13.57,28.68 ; 13.57,28.68 v1(13.57,22.73) ; 13.57,28.68 U3.2 U3.1 9.87,28.78 R9.1
  Bottom Layer w0.61: v1(13.57,22.73) v1(13.57,14.48)
XTAL1: length 9
  Top Layer w0.305: U6.9 46.08,27.16 45.47,26.54 45.47,25.27 C17.1 45.45,22.12 X1.1
XTAL2: length 9.1
  Top Layer w0.305: X1.2 48.1,22.29 C18.1 48.1,26.32 47.35,27.07 U6.10
$1N2: length 8.9
  Top Layer w0.305: U2.4 13.21,20.32 14.35,21.46 16.81,21.46 R5.1
$1N9: length 7.3
  Top Layer w0.305: R13.1 R12.1 28.02,20.51 C8.1 27.95,18.06 U4.3
$1N21: length 3.6
  Top Layer w0.305: C11.2 86.87,68.95 86.87,68.07 86.61,67.82 86.11,67.82 85.85,67.56 U5.1
$1N22: length 4.2
  Top Layer w0.305: U5.3 83.31,67.69 83.57,67.94 84.84,67.94 84.95,68.06 C11.1
$1N25: length 6.8
  Top Layer w0.305: U5.2 84.58,64.9 84.84,64.64 86.49,64.64 86.74,64.9 86.74,66.29 87.12,66.67 C13.2
$1N27: length 3
  Top Layer w0.305: C12.1 82.56,68.21 82.04,67.69 U5.4
$1N28: length 2.9
  Top Layer w0.305: C12.2 80.77,68.82 U5.5
$1N29: length 4.5
  Top Layer w0.305: C14.1 77.98,69.09 79.5,67.56 U5.6
$1N32: length 4.2
  Top Layer w0.305: U5.11 79.5,59.44 79.25,59.18 78.49,59.18 77.98,58.67 R19.2
$1N34: length 2.6
  Top Layer w0.305: R21.2 80.9,60.57 U5.12
$1N35: length 7
  Top Layer w0.305: R20.1 87.12,61.59 86.23,62.48 83.69,62.48 83.31,62.1 U5.14
$1N36: length 3.6
  Top Layer w0.305: R20.2 92.94,61.59 DB1.2
$1N37: length 9.5
  Top Layer w0.305: R22.1 87.96,63.88 82.35,63.88 82.04,63.58 U5.13
$1N38: length 3.6
  Top Layer w0.305: R22.2 92.84,64.26 DB1.3
$1N41: length 9.7
  Top Layer w0.61: U6.12 49.89,31.22 50.16,31.5 57.6,31.5 JP1.2
$1N43: length 13.6
  Top Layer w0.61: Q2.3 84.86,11.81 D2.2 84.99,11.94 91.95,11.94 93.34,10.54 RELAY1.2
$1N44: length 7.4
  Top Layer w0.61: R17.2 80,17.59 C9.1 80.03,15.08 Q2.1 77.71,12.76 R14.1
$1N59: length 5
  Top Layer w0.305: R10.2 R6.1 84.33,42.55 84.96,41.91 85.91,41.91 Q1.1
$1N60: length 16.8
  Top Layer w0.305: BUZ1.2 98.04,41.02 Q1.3 88.01,40.97 D1.2 88,37.35 C5.1
$1N64: length 4.3
  Top Layer w0.61: LCD2.3 15.08,82.76 R18.1
$1N97: length 3.5
  Top Layer w0.305: R1.1 62.1,4.87 LED1.1
$1N99: length 3.5
  Top Layer w0.305: LED3.1 52.09,4.85 R4.1
$1N100: length 3.5
  Top Layer w0.305: R3.1 57.11,4.87 LED2.1
$1N105: length 8.8
  Top Layer w0.305: 29.26,14.48 28.32,14.48 27.94,14.1 U4.6 ; 29.26,14.48 R25.2 ; 29.26,14.48 29.21,14.43 U4.7
$1N107: length 9.2
  Top Layer w0.305: R23.1 R24.1 23.94,14.43 C19.1 26.4,14.49 26.67,14.22 U4.5
$1N1047: length 15.8
  Top Layer w0.305: U2.2 5.46,13.08 6.05,12.5 R7.2
$1N2313: length 2.4
  Top Layer w0.305: R16.1 44.32,69.17 44.32,69.98 44.64,70.3 Q3.1
$1N2322: length 2.4
  Top Layer w0.305: 46.54,71.26 46.54,70.42 46.99,69.98 R15.1

## Copper pours and planes (outline as drawn; the poured copper is in the pictures)
GND on Top Layer: -4.44,89.53 109.47,89.53 109.47,-4.83 -4.44,-4.83
GND on Bottom Layer: -6.73,92.84 112.52,92.84 112.52,-6.35 -6.73,-6.35
VDD on Top Layer: 27.69,6.1 27.56,6.22 27.56,9.65 27.94,10.03 47.5,10.03 48.13,9.4 48.13,7.92 47.83,7.62 38.48,7.62 37.85,6.99 29.84,6.99 29.72,6.86 29.72,6.22 29.59,6.1
DC_IN on Top Layer: 13.21,4.83 12.83,5.21 12.83,9.65 13.21,10.03 18.16,10.03 18.42,10.29 18.42,13.08 18.54,13.21 19.81,13.21 19.94,13.08 19.94,6.48 19.69,6.22 15.75,6.22 15.62,6.1 15.62,4.95 15.49,4.83
$1N103 on Top Layer: 15.5,4.26 22.3,4.26 23.11,5.08 24.26,5.08 25.15,4.19 27.43,4.19 27.81,3.81 29.34,3.81 29.46,3.68 29.46,3.05 29.34,2.92 25.27,2.92 24.26,1.91 15.75,1.91 15.49,2.16 15.49,4.25

Small or netless copper shapes (teardrops, artwork), in the pictures only: 201 on Top Layer, 25 on Bottom Layer
